# EAGLE design PortExpander (EAGLE 8.2.2)
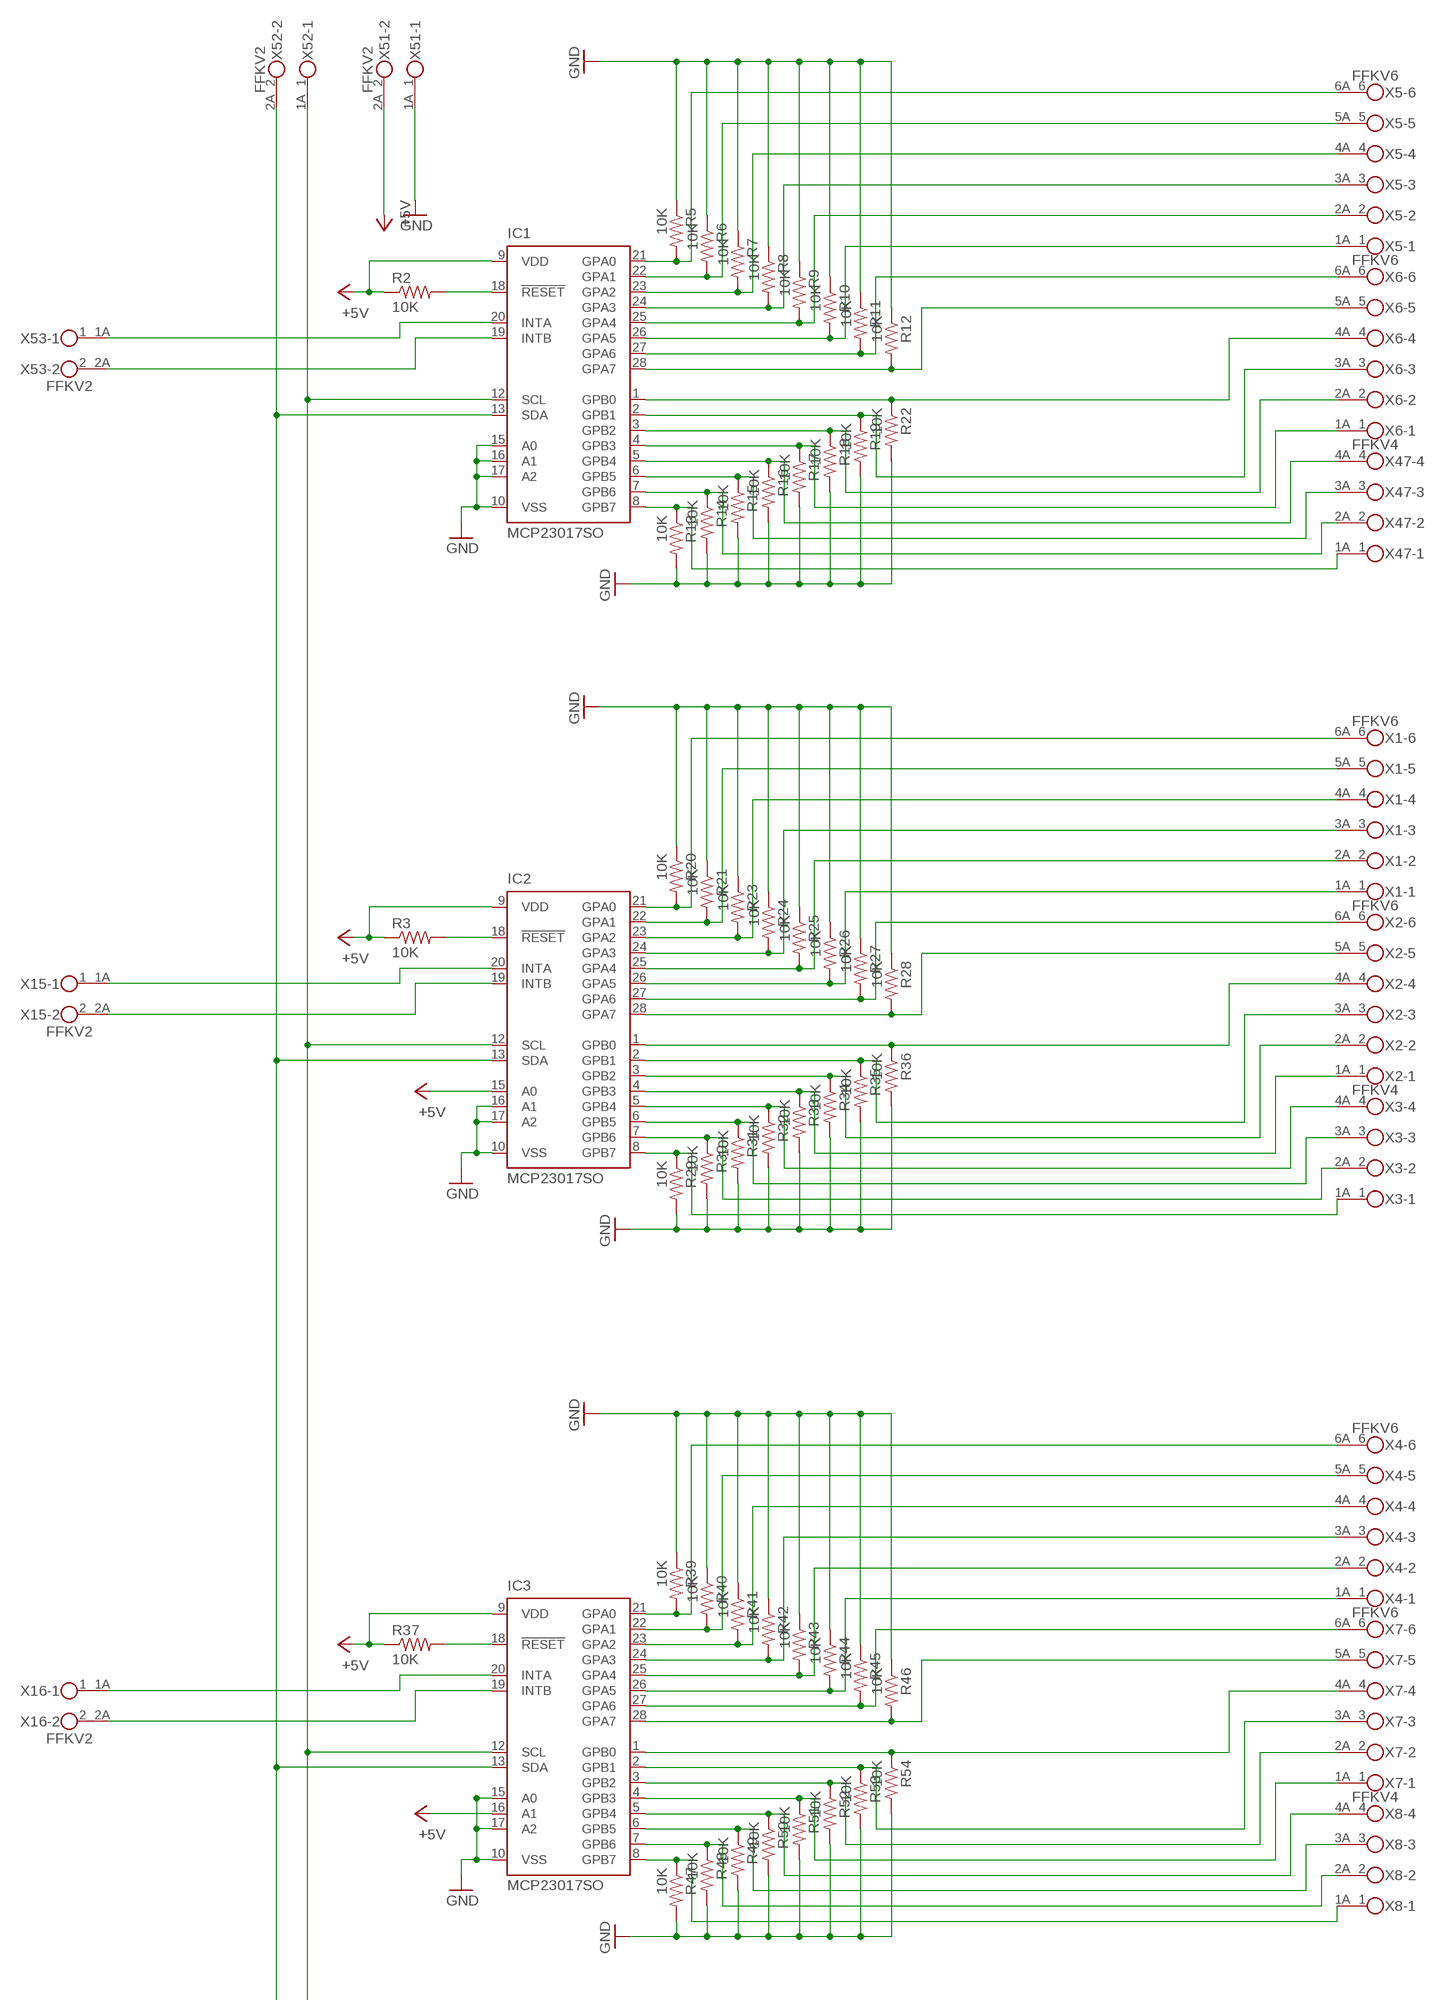
[diagram p0: schematic, sheet 1, part 1 of 2]
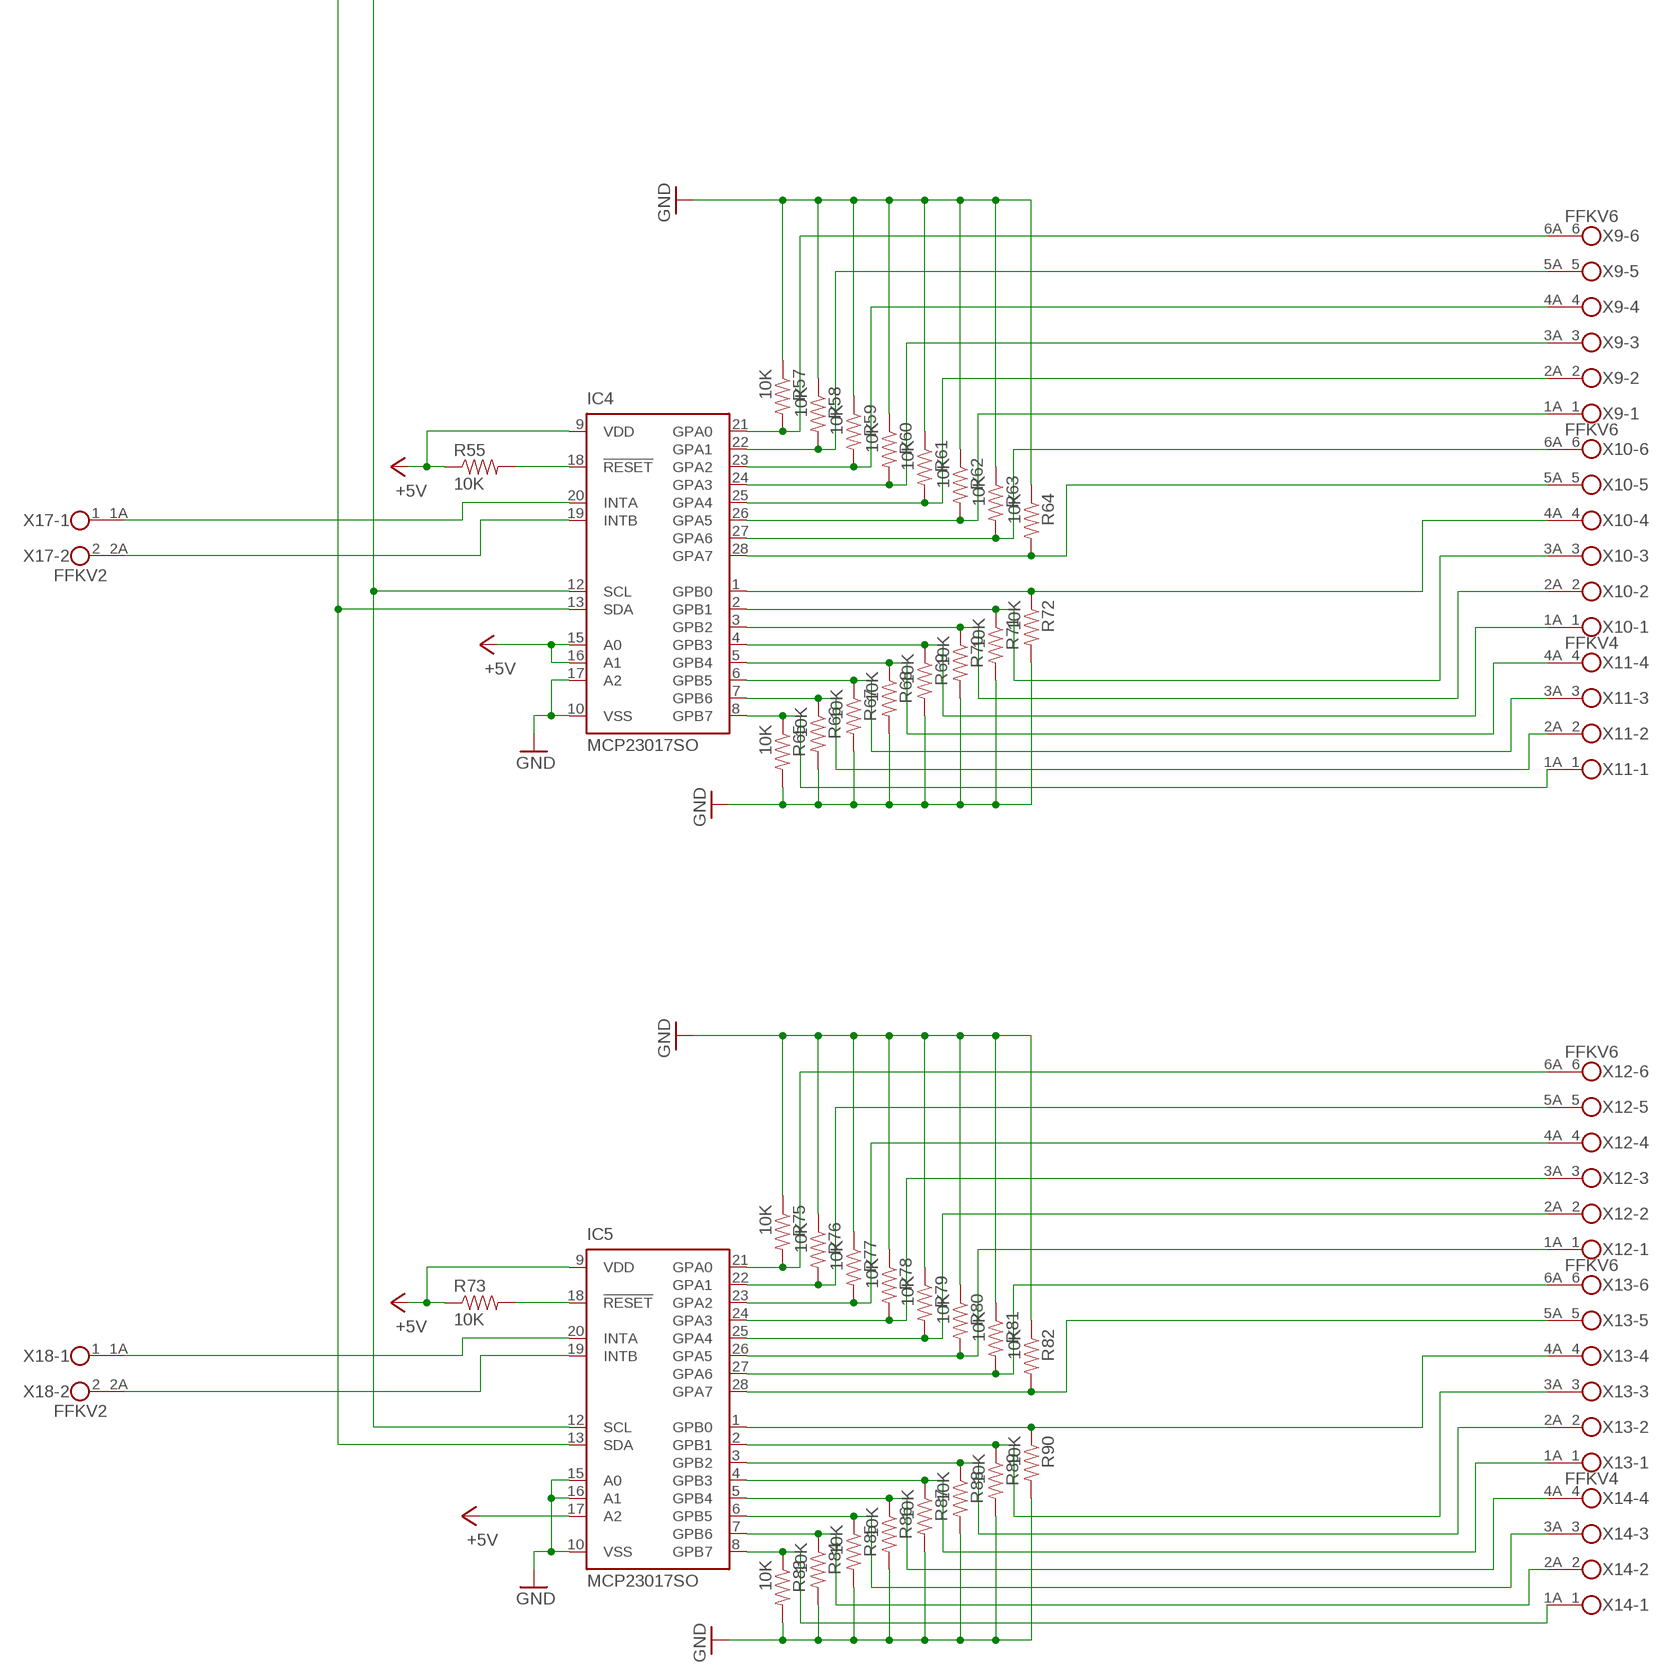
[diagram p1: schematic, sheet 1, part 2 of 2]

## Parts
IC1  MCP23017SO  [SO28W]
IC2  MCP23017SO  [SO28W]
IC3  MCP23017SO  [SO28W]
IC4  MCP23017SO  [SO28W]
IC5  MCP23017SO  [SO28W]
R2  10K  RESISTOR1206  [1206]
R3  10K  RESISTOR1206  [1206]
R5  10K  RESISTOR1206  [1206]
R6  10K  RESISTOR1206  [1206]
R7  10K  RESISTOR1206  [1206]
R8  10K  RESISTOR1206  [1206]
R9  10K  RESISTOR1206  [1206]
R10  10K  RESISTOR1206  [1206]
R11  10K  RESISTOR1206  [1206]
R12  10K  RESISTOR1206  [1206]
R13  10K  RESISTOR1206  [1206]
R14  10K  RESISTOR1206  [1206]
R15  10K  RESISTOR1206  [1206]
R16  10K  RESISTOR1206  [1206]
R17  10K  RESISTOR1206  [1206]
R18  10K  RESISTOR1206  [1206]
R19  10K  RESISTOR1206  [1206]
R20  10K  RESISTOR1206  [1206]
R21  10K  RESISTOR1206  [1206]
R22  10K  RESISTOR1206  [1206]
R23  10K  RESISTOR1206  [1206]
R24  10K  RESISTOR1206  [1206]
R25  10K  RESISTOR1206  [1206]
R26  10K  RESISTOR1206  [1206]
R27  10K  RESISTOR1206  [1206]
R28  10K  RESISTOR1206  [1206]
R29  10K  RESISTOR1206  [1206]
R30  10K  RESISTOR1206  [1206]
R31  10K  RESISTOR1206  [1206]
R32  10K  RESISTOR1206  [1206]
R33  10K  RESISTOR1206  [1206]
R34  10K  RESISTOR1206  [1206]
R35  10K  RESISTOR1206  [1206]
R36  10K  RESISTOR1206  [1206]
R37  10K  RESISTOR1206  [1206]
R39  10K  RESISTOR1206  [1206]
R40  10K  RESISTOR1206  [1206]
R41  10K  RESISTOR1206  [1206]
R42  10K  RESISTOR1206  [1206]
R43  10K  RESISTOR1206  [1206]
R44  10K  RESISTOR1206  [1206]
R45  10K  RESISTOR1206  [1206]
R46  10K  RESISTOR1206  [1206]
R47  10K  RESISTOR1206  [1206]
R48  10K  RESISTOR1206  [1206]
R49  10K  RESISTOR1206  [1206]
R50  10K  RESISTOR1206  [1206]
R51  10K  RESISTOR1206  [1206]
R52  10K  RESISTOR1206  [1206]
R53  10K  RESISTOR1206  [1206]
R54  10K  RESISTOR1206  [1206]
R55  10K  RESISTOR1206  [1206]
R57  10K  RESISTOR1206  [1206]
R58  10K  RESISTOR1206  [1206]
R59  10K  RESISTOR1206  [1206]
R60  10K  RESISTOR1206  [1206]
R61  10K  RESISTOR1206  [1206]
R62  10K  RESISTOR1206  [1206]
R63  10K  RESISTOR1206  [1206]
R64  10K  RESISTOR1206  [1206]
R65  10K  RESISTOR1206  [1206]
R66  10K  RESISTOR1206  [1206]
R67  10K  RESISTOR1206  [1206]
R68  10K  RESISTOR1206  [1206]
R69  10K  RESISTOR1206  [1206]
R70  10K  RESISTOR1206  [1206]
R71  10K  RESISTOR1206  [1206]
R72  10K  RESISTOR1206  [1206]
R73  10K  RESISTOR1206  [1206]
R75  10K  RESISTOR1206  [1206]
R76  10K  RESISTOR1206  [1206]
R77  10K  RESISTOR1206  [1206]
R78  10K  RESISTOR1206  [1206]
R79  10K  RESISTOR1206  [1206]
R80  10K  RESISTOR1206  [1206]
R81  10K  RESISTOR1206  [1206]
R82  10K  RESISTOR1206  [1206]
R83  10K  RESISTOR1206  [1206]
R84  10K  RESISTOR1206  [1206]
R85  10K  RESISTOR1206  [1206]
R86  10K  RESISTOR1206  [1206]
R87  10K  RESISTOR1206  [1206]
R88  10K  RESISTOR1206  [1206]
R89  10K  RESISTOR1206  [1206]
R90  10K  RESISTOR1206  [1206]
X1  FFKV6  [FFKV6]
X2  FFKV6  [FFKV6]
X3  FFKV4  [FFKV4]
X4  FFKV6  [FFKV6]
X5  FFKV6  [FFKV6]
X6  FFKV6  [FFKV6]
X7  FFKV6  [FFKV6]
X8  FFKV4  [FFKV4]
X9  FFKV6  [FFKV6]
X10  FFKV6  [FFKV6]
X11  FFKV4  [FFKV4]
X12  FFKV6  [FFKV6]
X13  FFKV6  [FFKV6]
X14  FFKV4  [FFKV4]
X15  FFKV2  [FFKV2]
X16  FFKV2  [FFKV2]
X17  FFKV2  [FFKV2]
X18  FFKV2  [FFKV2]
X47  FFKV4  [FFKV4]
X51  FFKV2  [FFKV2]
X52  FFKV2  [FFKV2]
X53  FFKV2  [FFKV2]

## Nets
+5V: IC1.9(VDD) IC2.9(VDD) IC2.15(A0) IC3.9(VDD) IC3.16(A1) IC4.9(VDD) IC4.15(A0) IC4.16(A1) IC5.9(VDD) IC5.17(A2) R2.1 R3.1 R37.1 R55.1 R73.1 X51.2A
GND: IC1.10(VSS) IC1.15(A0) IC1.16(A1) IC1.17(A2) IC2.10(VSS) IC2.16(A1) IC2.17(A2) IC3.10(VSS) IC3.15(A0) IC3.17(A2) IC4.10(VSS) IC4.17(A2) IC5.10(VSS) IC5.15(A0) IC5.16(A1) R5.1 R6.1 R7.1 R8.1 R9.1 R10.1 R11.1 R12.1 R13.2 R14.2 R15.2 R16.2 R17.2 R18.2 R19.2 R20.1 R21.1 R22.2 R23.1 R24.1 R25.1 R26.1 R27.1 R28.1 R29.2 R30.2 R31.2 R32.2 R33.2 R34.2 R35.2 R36.2 R39.1 R40.1 R41.1 R42.1 R43.1 R44.1 R45.1 R46.1 R47.2 R48.2 R49.2 R50.2 R51.2 R52.2 R53.2 R54.2 R57.1 R58.1 R59.1 R60.1 R61.1 R62.1 R63.1 R64.1 R65.2 R66.2 R67.2 R68.2 R69.2 R70.2 R71.2 R72.2 R75.1 R76.1 R77.1 R78.1 R79.1 R80.1 R81.1 R82.1 R83.2 R84.2 R85.2 R86.2 R87.2 R88.2 R89.2 R90.2 X51.1A
N$1: IC1.18(!RESET) R2.2
N$2: IC2.18(!RESET) R3.2
N$3: IC1.21(GPA0) R5.2 X5.6A
N$4: IC1.22(GPA1) R6.2 X5.5A
N$5: IC1.23(GPA2) R7.2 X5.4A
N$6: IC1.24(GPA3) R8.2 X5.3A
N$7: IC1.25(GPA4) R9.2 X5.2A
N$8: IC1.26(GPA5) R10.2 X5.1A
N$9: IC1.27(GPA6) R11.2 X6.6A
N$10: IC1.28(GPA7) R12.2 X6.5A
N$11: IC2.20(INTA) X15.1A
N$12: IC1.8(GPB7) R13.1 X47.1A
N$13: IC1.7(GPB6) R14.1 X47.2A
N$14: IC1.6(GPB5) R15.1 X47.3A
N$15: IC1.5(GPB4) R16.1 X47.4A
N$16: IC1.4(GPB3) R17.1 X6.1A
N$17: IC1.3(GPB2) R18.1 X6.2A
N$18: IC1.2(GPB1) R19.1 X6.3A
N$19: IC1.1(GPB0) R22.1 X6.4A
N$20: IC2.19(INTB) X15.2A
N$23: IC2.21(GPA0) R20.2 X1.6A
N$24: IC2.22(GPA1) R21.2 X1.5A
N$25: IC2.23(GPA2) R23.2 X1.4A
N$26: IC2.24(GPA3) R24.2 X1.3A
N$27: IC2.25(GPA4) R25.2 X1.2A
N$28: IC2.26(GPA5) R26.2 X1.1A
N$29: IC2.27(GPA6) R27.2 X2.6A
N$30: IC2.28(GPA7) R28.2 X2.5A
N$31: IC2.8(GPB7) R29.1 X3.1A
N$32: IC2.7(GPB6) R30.1 X3.2A
N$33: IC2.6(GPB5) R31.1 X3.3A
N$34: IC2.5(GPB4) R32.1 X3.4A
N$35: IC2.4(GPB3) R33.1 X2.1A
N$36: IC2.3(GPB2) R34.1 X2.2A
N$37: IC2.2(GPB1) R35.1 X2.3A
N$38: IC2.1(GPB0) R36.1 X2.4A
N$39: IC3.18(!RESET) R37.2
N$40: IC3.20(INTA) X16.1A
N$41: IC3.19(INTB) X16.2A
N$44: IC3.21(GPA0) R39.2 X4.6A
N$45: IC3.22(GPA1) R40.2 X4.5A
N$46: IC3.23(GPA2) R41.2 X4.4A
N$47: IC3.24(GPA3) R42.2 X4.3A
N$48: IC3.25(GPA4) R43.2 X4.2A
N$49: IC3.26(GPA5) R44.2 X4.1A
N$50: IC3.27(GPA6) R45.2 X7.6A
N$51: IC3.28(GPA7) R46.2 X7.5A
N$52: IC3.8(GPB7) R47.1 X8.1A
N$53: IC3.7(GPB6) R48.1 X8.2A
N$54: IC3.6(GPB5) R49.1 X8.3A
N$55: IC3.5(GPB4) R50.1 X8.4A
N$56: IC3.4(GPB3) R51.1 X7.1A
N$57: IC3.3(GPB2) R52.1 X7.2A
N$58: IC3.2(GPB1) R53.1 X7.3A
N$59: IC3.1(GPB0) R54.1 X7.4A
N$60: IC4.18(!RESET) R55.2
N$61: IC4.20(INTA) X17.1A
N$62: IC4.19(INTB) X17.2A
N$65: IC4.21(GPA0) R57.2 X9.6A
N$66: IC4.22(GPA1) R58.2 X9.5A
N$67: IC4.23(GPA2) R59.2 X9.4A
N$68: IC4.24(GPA3) R60.2 X9.3A
N$69: IC1.20(INTA) X53.1A
N$70: IC1.19(INTB) X53.2A
N$71: IC4.25(GPA4) R61.2 X9.2A
N$72: IC4.26(GPA5) R62.2 X9.1A
N$73: IC4.27(GPA6) R63.2 X10.6A
N$74: IC4.28(GPA7) R64.2 X10.5A
N$75: IC4.8(GPB7) R65.1 X11.1A
N$76: IC4.7(GPB6) R66.1 X11.2A
N$77: IC4.6(GPB5) R67.1 X11.3A
N$78: IC4.5(GPB4) R68.1 X11.4A
N$79: IC4.4(GPB3) R69.1 X10.1A
N$80: IC4.3(GPB2) R70.1 X10.2A
N$81: IC4.2(GPB1) R71.1 X10.3A
N$82: IC4.1(GPB0) R72.1 X10.4A
N$83: IC5.18(!RESET) R73.2
N$84: IC5.20(INTA) X18.1A
N$85: IC5.19(INTB) X18.2A
N$88: IC5.21(GPA0) R75.2 X12.6A
N$89: IC5.22(GPA1) R76.2 X12.5A
N$90: IC5.23(GPA2) R77.2 X12.4A
N$93: IC5.24(GPA3) R78.2 X12.3A
N$94: IC5.25(GPA4) R79.2 X12.2A
N$95: IC5.26(GPA5) R80.2 X12.1A
N$96: IC5.27(GPA6) R81.2 X13.6A
N$97: IC5.28(GPA7) R82.2 X13.5A
N$98: IC5.8(GPB7) R83.1 X14.1A
N$99: IC5.7(GPB6) R84.1 X14.2A
N$100: IC5.6(GPB5) R85.1 X14.3A
N$101: IC5.5(GPB4) R86.1 X14.4A
N$102: IC5.4(GPB3) R87.1 X13.1A
N$103: IC5.3(GPB2) R88.1 X13.2A
N$104: IC5.2(GPB1) R89.1 X13.3A
N$105: IC5.1(GPB0) R90.1 X13.4A
SCL: IC1.12(SCL) IC2.12(SCL) IC3.12(SCL) IC4.12(SCL) IC5.12(SCL) X52.1A
SDA: IC1.13(SDA) IC2.13(SDA) IC3.13(SDA) IC4.13(SDA) IC5.13(SDA) X52.2A
Unconnected: X1.1 X1.2 X1.3 X1.4 X1.5 X1.6 X2.1 X2.2 X2.3 X2.4 X2.5 X2.6 X3.1 X3.2 X3.3 X3.4 X4.1 X4.2 X4.3 X4.4 X4.5 X4.6 X5.1 X5.2 X5.3 X5.4 X5.5 X5.6 X6.1 X6.2 X6.3 X6.4 X6.5 X6.6 X7.1 X7.2 X7.3 X7.4 X7.5 X7.6 X8.1 X8.2 X8.3 X8.4 X9.1 X9.2 X9.3 X9.4 X9.5 X9.6 X10.1 X10.2 X10.3 X10.4 X10.5 X10.6 X11.1 X11.2 X11.3 X11.4 X12.1 X12.2 X12.3 X12.4 X12.5 X12.6 X13.1 X13.2 X13.3 X13.4 X13.5 X13.6 X14.1 X14.2 X14.3 X14.4 X15.1 X15.2 X16.1 X16.2 X17.1 X17.2 X18.1 X18.2 X47.1 X47.2 X47.3 X47.4 X51.1 X51.2 X52.1 X52.2 X53.1 X53.2

## Library data of the parts
IC1-IC5 = microchip:MCP23017: http://ww1.microchip.com/downloads/en/DeviceDoc/21952a.pdf Source: http://ww1.microchip.com/downloads/en/DeviceDoc/21952a.pdf; MF: MICROCHIP; MPN: MCP23017-E/SO; OC_FARNELL: 1332087; OC_NEWARK: 31K2958
R2 R3 R5-R37 R39-R55 R57-R73 R75-R90 = SparkFun-Passives:RESISTOR: Resistor Basic schematic elements and footprints for 0603, 1206, and PTH resistors.
X1 X2 X4-X7 X9 X10 X12 X13 = con-phoenix-508:FFKV6: PHOENIX; OC_FARNELL: unknown; OC_NEWARK: unknown
X3 X8 X11 X14 X47 = con-phoenix-508:FFKV4: PHOENIX; OC_FARNELL: unknown; OC_NEWARK: unknown
X15-X18 X51-X53 = con-phoenix-508:FFKV2: PHOENIX; OC_FARNELL: unknown; OC_NEWARK: unknown

## Board
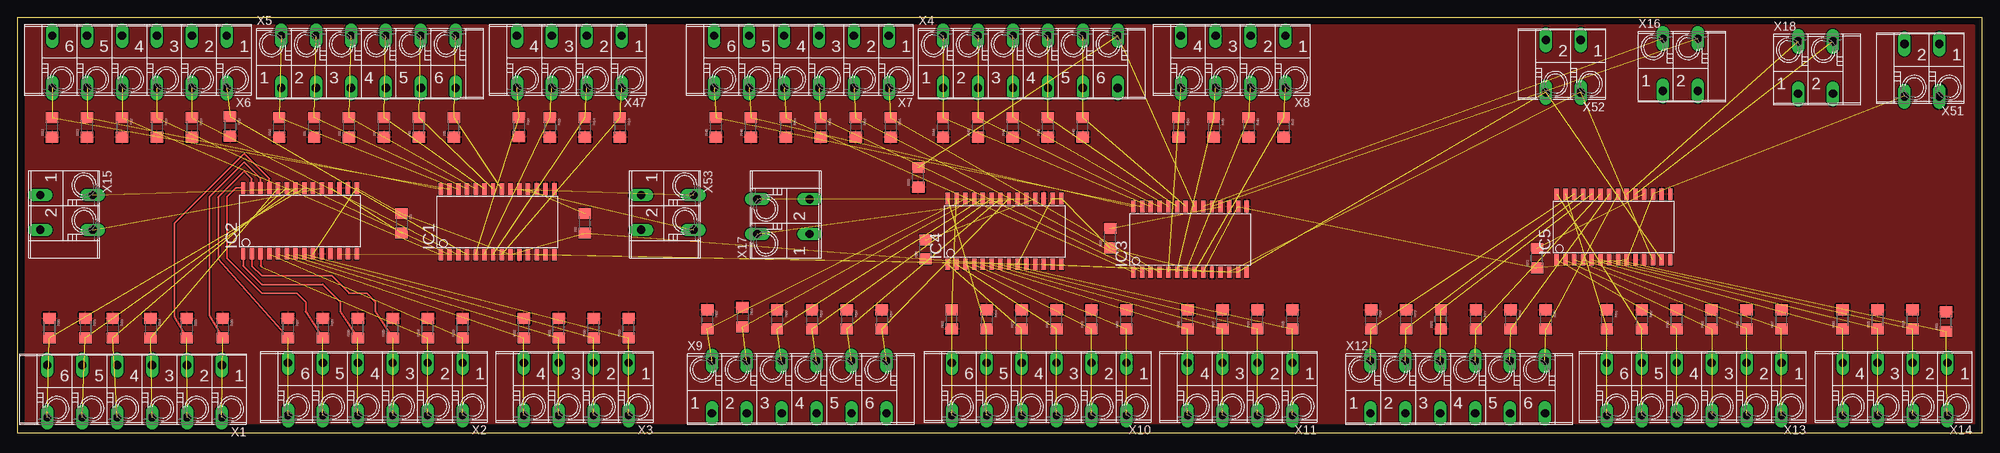
[diagram p2: board, top side]

Size 285.73 x 60.36 mm. Coordinates in mm from the lower left corner, seen from the top.
Outline: 0,0 285.73,0 285.73,60.36 0,60.36 0,0
Copper layers (1*16): Top 0.035mm / dielectric 1.5mm / Bottom 0.035mm
Design rules "default": minimum track width 6mil, minimum drill 0.35mm, track to track 6mil, track to pad 6mil, pad to pad 6mil, via to via 6mil, smd to smd 6mil, copper to edge 40mil, drill to drill 6mil, minimum pad ring 10mil, minimum via ring 8mil, stop-mask expansion 4mil, vias tented up to drill 0mil, thermal gap 10mil

### Footprints (pad centres in the part's own frame; a part is rotated, then mirrored left to right if it is on the bottom)
SO28W = smd 0.65 x 1.7: 1 -7.62,-4.78; 2 -6.35,-4.78; 3 -5.08,-4.78; 4 -3.81,-4.78; 5 -2.54,-4.78; 6 -1.27,-4.78; 7 0,-4.78; 8 1.27,-4.78; 9 2.54,-4.78; 10 3.81,-4.78; 11 5.08,-4.78; 12 6.35,-4.78; 13 7.62,-4.78; 14 8.89,-4.78; 15 8.89,4.78; 16 7.62,4.78; 17 6.35,4.78; 18 5.08,4.78; 19 3.81,4.78; 20 2.54,4.78; 21 1.27,4.78; 22 0,4.78; 23 -1.27,4.78; 24 -2.54,4.78; 25 -3.81,4.78; 26 -5.08,4.78; 27 -6.35,4.78; 28 -7.62,4.78
1206 = smd 1.6 x 1.8: 1 -1.4,0; 2 1.4,0
FFKV6 = drill 1.194 long: 1 -12.7,-3.81; 1A -12.7,3.81; 2 -7.62,-3.81; 2A -7.62,3.81; 3 -2.54,-3.81; 3A -2.54,3.81; 4 2.54,-3.81; 4A 2.54,3.81; 5 7.62,-3.81; 5A 7.62,3.81; 6 12.7,-3.81; 6A 12.7,3.81
FFKV4 = drill 1.194 long: 1 -7.62,-3.81; 1A -7.62,3.81; 2 -2.54,-3.81; 2A -2.54,3.81; 3 2.54,-3.81; 3A 2.54,3.81; 4 7.62,-3.81; 4A 7.62,3.81
FFKV2 = drill 1.194 long: 1 -2.54,-3.81; 1A -2.54,3.81; 2 2.54,-3.81; 2A 2.54,3.81

### Placement (x,y rotation side)
IC1  69.2,30.69 0 top
IC2  40.48,30.82 0 top
IC3  169.91,28.15 0 top
IC4  142.94,29.3 0 top
IC5  231.48,29.94 0 top
R2  82.55,30.48 90 top
R3  55.88,30.48 270 top
R5  63.5,44.45 90 top
R6  58.42,44.45 90 top
R7  53.34,44.45 90 top
R8  48.26,44.45 90 top
R9  43.18,44.45 90 top
R10  38.1,44.45 90 top
R11  5.08,44.45 90 top
R12  10.16,44.45 90 top
R13  87.63,44.45 270 top
R14  82.55,44.45 270 top
R15  77.47,44.45 270 top
R16  72.95,44.49 270 top
R17  30.95,44.57 270 top
R18  25.4,44.45 270 top
R19  20.32,44.45 270 top
R20  4.68,15.24 270 top
R21  9.92,15.24 270 top
R22  15.24,44.45 270 top
R23  13.89,15.24 270 top
R24  19.4,15.24 270 top
R25  24.64,15.24 270 top
R26  29.88,15.24 270 top
R27  39.37,15.24 270 top
R28  44.45,15.24 270 top
R29  88.9,15.24 90 top
R30  83.82,15.24 90 top
R31  78.74,15.24 90 top
R32  73.66,15.24 90 top
R33  64.77,15.24 90 top
R34  59.69,15.24 90 top
R35  54.61,15.24 90 top
R36  49.53,15.24 90 top
R37  158.91,28.3 90 top
R39  130.99,37.18 90 top
R40  154.94,44.45 90 top
R41  149.86,44.45 90 top
R42  144.78,44.45 90 top
R43  139.7,44.45 90 top
R44  134.62,44.45 90 top
R45  101.6,44.45 90 top
R46  106.68,44.45 90 top
R47  184.15,44.45 270 top
R48  179.07,44.45 270 top
R49  173.99,44.45 270 top
R50  168.91,44.45 270 top
R51  127,44.45 270 top
R52  121.92,44.45 270 top
R53  116.84,44.45 270 top
R54  111.76,44.45 270 top
R55  132.08,26.67 90 top
R57  125.73,16.51 270 top
R58  120.65,16.51 270 top
R59  115.57,16.51 270 top
R60  110.49,16.51 270 top
R61  105.46,16.84 270 top
R62  100.33,16.51 270 top
R63  135.89,16.51 90 top
R64  140.97,16.51 270 top
R65  185.42,16.51 90 top
R66  180.34,16.51 90 top
R67  175.26,16.51 90 top
R68  170.18,16.51 90 top
R69  161.29,16.51 90 top
R70  156.21,16.51 90 top
R71  151.13,16.51 90 top
R72  146.05,16.51 90 top
R73  220.98,25.4 90 top
R75  222.25,16.51 270 top
R76  217.17,16.51 270 top
R77  212.09,16.51 270 top
R78  207.01,16.51 90 top
R79  201.93,16.51 270 top
R80  196.85,16.51 270 top
R81  231.14,16.51 270 top
R82  236.22,16.51 270 top
R83  280.46,16.16 90 top
R84  275.59,16.51 90 top
R85  270.51,16.51 90 top
R86  265.43,16.51 90 top
R87  256.54,16.51 90 top
R88  251.46,16.51 90 top
R89  246.38,16.51 90 top
R90  241.3,16.51 90 top
X1  17.07,6.05 180 top
X2  52.07,6.35 180 top
X3  81.28,6.35 180 top
X4  147.32,53.98 0 top
X5  51.07,53.98 0 top
X6  17.78,53.98 180 top
X7  114.03,53.98 180 top
X8  176.8,53.98 180 top
X9  113.7,6.65 0 top
X10  148.59,6.35 180 top
X11  177.8,6.35 180 top
X12  209.45,6.65 0 top
X13  243.84,6.35 180 top
X14  273.05,6.35 180 top
X15  7.16,32.07 270 top
X16  241.81,53.55 0 top
X17  111.41,31.45 90 top
X18  261.48,53.14 0 top
X47  80.28,53.98 180 top
X51  276.95,52.77 180 top
X52  224.79,53.34 180 top
X53  94.52,32.07 270 top

### Tracks (layer width: path | path; a pad name or v marks a point on that pad's centre or on a via)
+5V  (15 unrouted)
GND
  pour Top: 0,60.96 285.75,60.96 285.75,1.27 0,1.27
N$1  (1 unrouted)
N$2  (1 unrouted)
N$3  (2 unrouted)
N$4  (2 unrouted)
N$5  (2 unrouted)
N$6  (2 unrouted)
N$7  (2 unrouted)
N$8  (2 unrouted)
N$9  (2 unrouted)
N$10  (2 unrouted)
N$11  (1 unrouted)
N$12  (2 unrouted)
N$13  (2 unrouted)
N$14  (2 unrouted)
N$15  (2 unrouted)
N$16  (2 unrouted)
N$17  (2 unrouted)
N$18  (2 unrouted)
N$19  (2 unrouted)
N$20  (1 unrouted)
N$23  (2 unrouted)
N$24  (2 unrouted)
N$25  (2 unrouted)
N$26  (2 unrouted)
N$27  (1 unrouted)
  Top 0.305: IC2.25 36.67,36.99 33.02,40.64 22.86,30.48 22.86,16.89 R25.2
N$28  (1 unrouted)
  Top 0.305: IC2.26 35.4,36.99 33.02,39.37 27.94,34.29 27.94,17.05 R26.2
N$29  (1 unrouted)
  Top 0.305: IC2.27 34.13,36.99 33.02,38.1 29.21,34.29 29.21,25.27 R27.2
N$30  (1 unrouted)
  Top 0.305: IC2.28 31.79,35.6 30.48,34.29 30.48,25.4 35.56,20.32 40.64,20.32 41.91,19.05 41.91,17.65 R28.2
N$31  (2 unrouted)
N$32  (2 unrouted)
N$33  (2 unrouted)
N$34  (2 unrouted)
N$35  (2 unrouted)
N$36  (2 unrouted)
  Top 0.305: IC2.3 35.4,24.29 35.56,24.13
N$37  (1 unrouted)
  Top 0.305: IC2.2 34.13,24.29 35.56,22.86 45.72,22.86 48.26,20.32 50.8,20.32 52.07,19.05 52.07,17.65 R35.1
N$38  (1 unrouted)
  Top 0.305: IC2.1 32.86,24.29 35.56,21.59 44.45,21.59 46.99,19.05 46.99,17.65 R36.1
N$39  (1 unrouted)
N$40  (1 unrouted)
N$41  (1 unrouted)
N$44  (2 unrouted)
N$45  (2 unrouted)
N$46  (2 unrouted)
N$47  (2 unrouted)
N$48  (2 unrouted)
N$49  (2 unrouted)
N$50  (2 unrouted)
N$51  (2 unrouted)
N$52  (2 unrouted)
N$53  (2 unrouted)
N$54  (2 unrouted)
N$55  (2 unrouted)
N$56  (2 unrouted)
N$57  (2 unrouted)
N$58  (2 unrouted)
N$59  (2 unrouted)
N$60  (1 unrouted)
N$61  (1 unrouted)
N$62  (1 unrouted)
N$65  (2 unrouted)
N$66  (2 unrouted)
N$67  (2 unrouted)
N$68  (2 unrouted)
N$69  (1 unrouted)
N$70  (1 unrouted)
N$71  (2 unrouted)
N$72  (2 unrouted)
N$73  (2 unrouted)
N$74  (2 unrouted)
N$75  (2 unrouted)
N$76  (2 unrouted)
N$77  (2 unrouted)
N$78  (2 unrouted)
N$79  (2 unrouted)
N$80  (2 unrouted)
N$81  (2 unrouted)
N$82  (2 unrouted)
N$83  (1 unrouted)
N$84  (1 unrouted)
N$85  (1 unrouted)
N$88  (2 unrouted)
N$89  (2 unrouted)
N$90  (2 unrouted)
N$93  (2 unrouted)
N$94  (2 unrouted)
N$95  (2 unrouted)
N$96  (2 unrouted)
N$97  (2 unrouted)
N$98  (2 unrouted)
N$99  (2 unrouted)
N$100  (2 unrouted)
N$101  (2 unrouted)
N$102  (2 unrouted)
N$103  (2 unrouted)
N$104  (2 unrouted)
N$105  (2 unrouted)
SCL  (5 unrouted)
SDA  (5 unrouted)